# EAGLE design Mini PIC18F-USB Trainer_SCH (EAGLE 9.6.2)
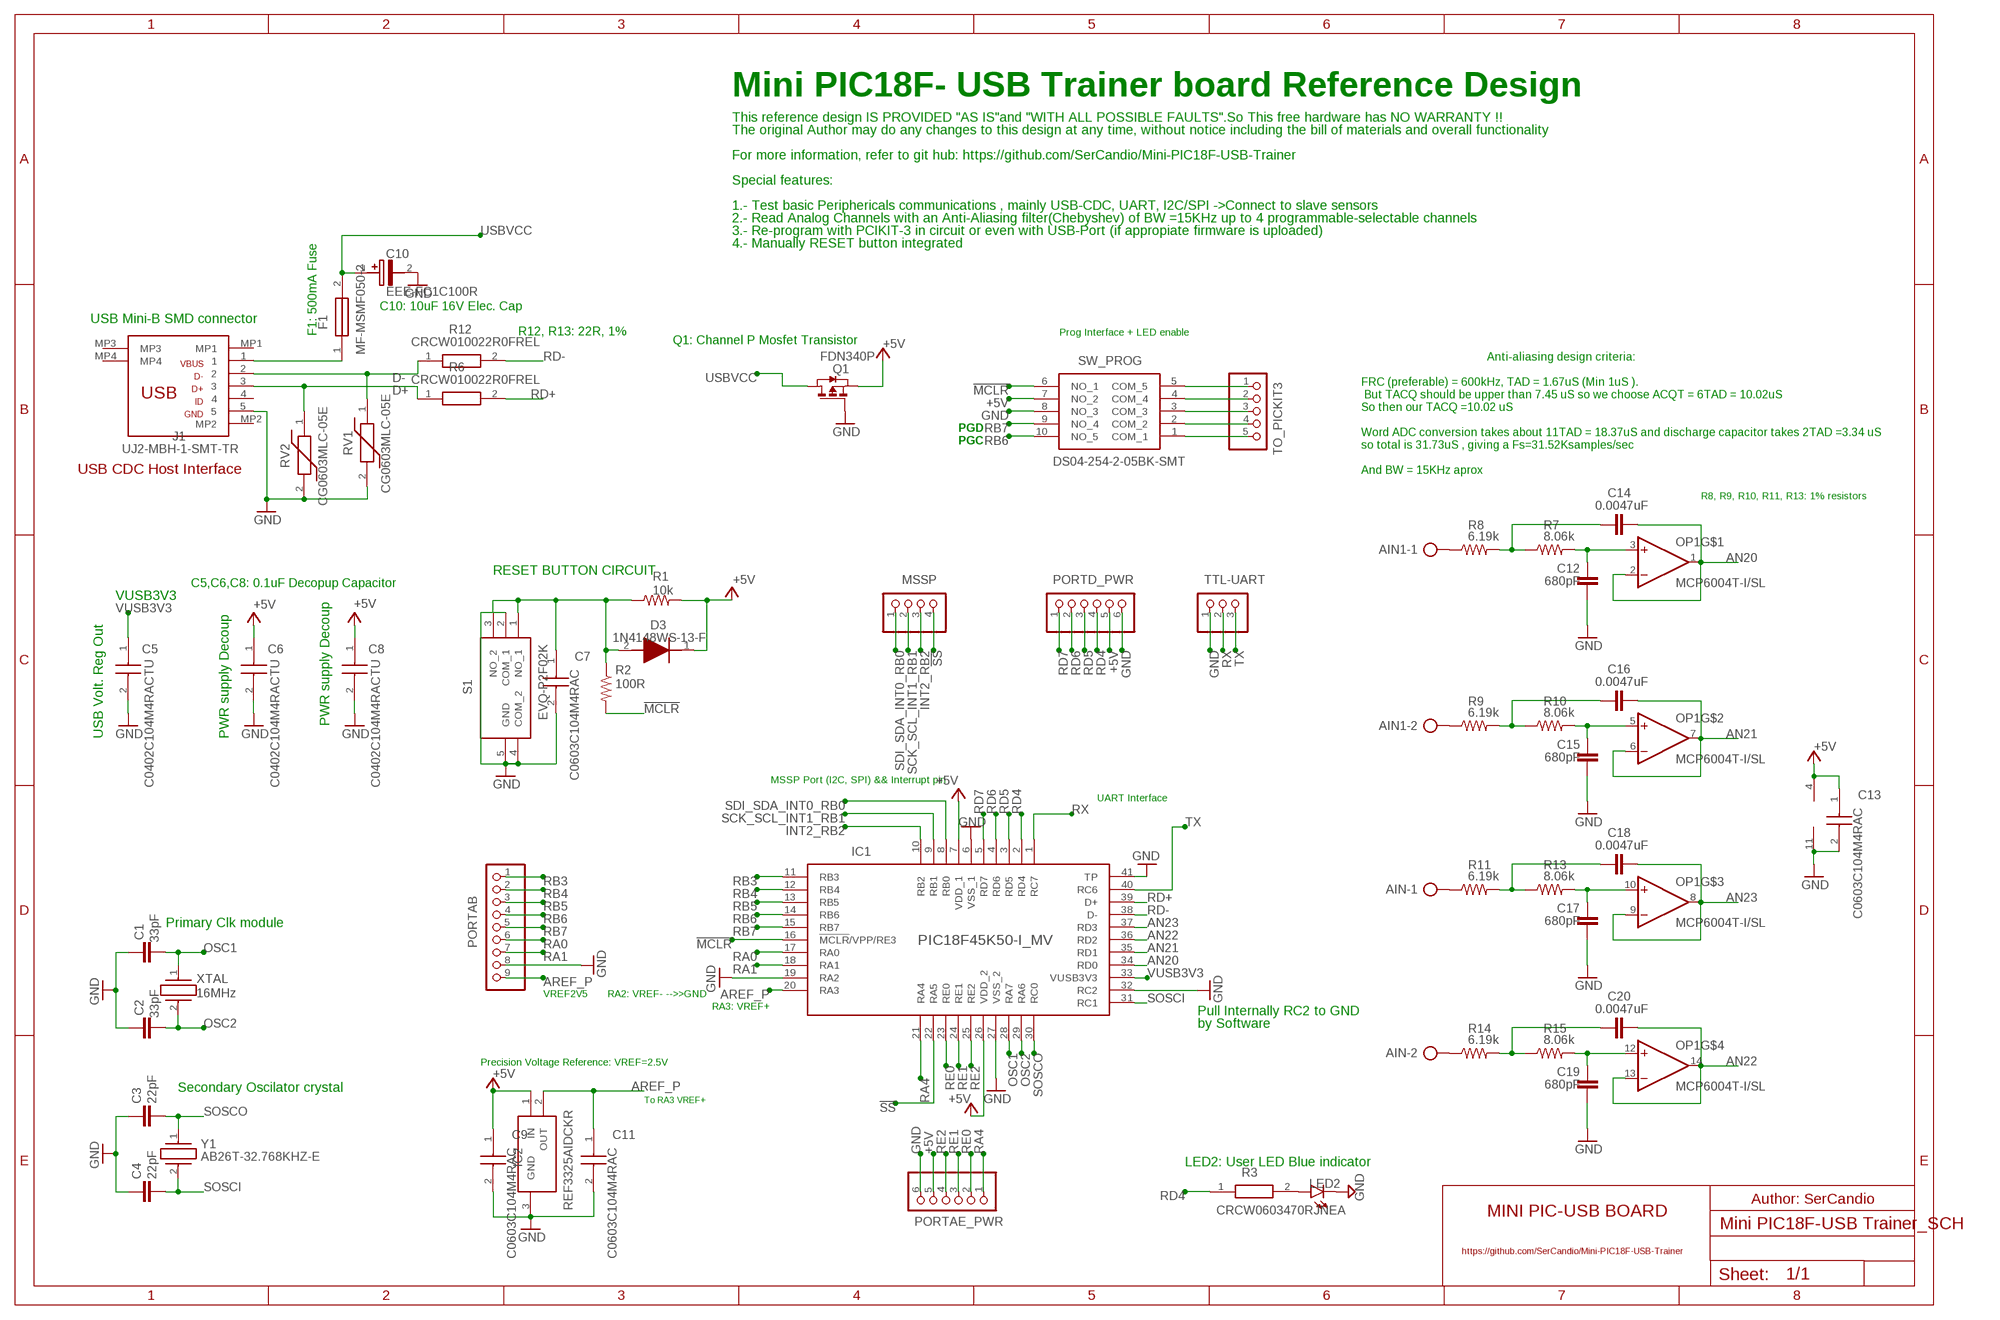
[diagram p0: schematic, sheet 1]

## Parts
AIN  AK500/2-H  [AK500/2-H]
AIN1  AK500/2-H  [AK500/2-H]
C1  33pF  C-EUC0603K  [C0603K]
C2  33pF  C-EUC0603K  [C0603K]
C3  22pF  C-EUC0603K  [C0603K]
C4  22pF  C-EUC0603K  [C0603K]
C5  C0402C104M4RACTU  [C0402C104J4RACTU]
C6  C0402C104M4RACTU  [C0402C104J4RACTU]
C7  C0603C104M4RAC  [CAPC1608X95N]
C8  C0402C104M4RACTU  [C0402C104J4RACTU]
C9  C0603C104M4RAC  [CAPC1608X95N]
C10  EEE-FC1C100R  [EEE1AA220WR]
C11  C0603C104M4RAC  [CAPC1608X95N]
C12  680pF  C-EUC0603K  [C0603K]
C13  C0603C104M4RAC  [CAPC1608X95N]
C14  0.0047uF  C-EUC0603K  [C0603K]
C15  680pF  C-EUC0603K  [C0603K]
C16  0.0047uF  C-EUC0603K  [C0603K]
C17  680pF  C-EUC0603K  [C0603K]
C18  0.0047uF  C-EUC0603K  [C0603K]
C19  680pF  C-EUC0603K  [C0603K]
C20  0.0047uF  C-EUC0603K  [C0603K]
D3  1N4148WS-13-F  [SOD2513X120N]
F1  MF-MSMF050-2  [FUSC4632X85N]
IC1  PIC18F45K50-I_MV  [QFN40P500X500X55-41N]
IC2  REF3325AIDCKR  [SOT65P210X110-3N]
J1  UJ2-MBH-1-SMT-TR  [UJ2MBH1SMTTR]
LED2  LEDCHIP-LED0805  [CHIP-LED0805]
MSSP  PINHD-1X4  [1X04]
OP1  MCP6004T-I/SL  [SOIC127P600X175-14M]
PORTAB  PINHD-1X9  [1X09]
PORTAE_PWR  PINHD-1X6  [1X06]
PORTD_PWR  PINHD-1X6  [1X06]
Q1  FDN340P  [SOT95P237X112-3N]
R1  10k  R-US_R0402  [R0402]
R2  100R  R-US_R0402  [R0402]
R3  CRCW0603470RJNEA  [RESC1608X50N]
R6  CRCW010022R0FREL  [RESC0402X15N]
R7  8.06k  R-US_R0603  [R0603]
R8  6.19k  R-US_R0603  [R0603]
R9  6.19k  R-US_R0603  [R0603]
R10  8.06k  R-US_R0603  [R0603]
R11  6.19k  R-US_R0603  [R0603]
R12  CRCW010022R0FREL  [RESC0402X15N]
R13  8.06k  R-US_R0603  [R0603]
R14  6.19k  R-US_R0603  [R0603]
R15  8.06k  R-US_R0603  [R0603]
RV1  CG0603MLC-05E  [VARC1608X55N]
RV2  CG0603MLC-05E  [VARC1608X55N]
S1  EVQ-P2F02K  [EVQP2V02W]
SW_PROG  DS04-254-2-05BK-SMT  [DS04254205BKSMT]
TO_PICKIT3  PINHD-1X5/90  [1X05/90]
TTL-UART  PINHD-1X3/90  [1X03/90]
XTAL  16MHz  LFXTAL003237REEL  [LFXTAL020423CUTT]
Y1  AB26T-32.768KHZ-E  [AB26T32768KHZE]

## Nets
!MCLR: IC1.16(!MCLR!/VPP/RE3) R2.2 SW_PROG.6(NO_1)
!SS: IC1.22(RA5) MSSP.4
+5V: C6.1 C8.1 C9.1 C13.1 D3.1(K) IC1.7(VDD_1) IC1.26(VDD_2) IC2.1(IN) OP1.4(V+) PORTAE_PWR.5 PORTD_PWR.5 Q1.2(S) R1.2 SW_PROG.7(NO_2)
AN20: C14.2 IC1.34(RD0) OP1.1(OUT) OP1.2(-IN)
AN21: C16.2 IC1.35(RD1) OP1.6(-IN) OP1.7(OUT)
AN22: C20.2 IC1.36(RD2) OP1.13(-IN) OP1.14(OUT)
AN23: C18.2 IC1.37(RD3) OP1.8(OUT) OP1.9(-IN)
AREF_P: C11.1 IC1.20(RA3) IC2.2(OUT) PORTAB.9
D+: J1.3 R6.1 RV2.1
D-: J1.2 R12.1 RV1.1
GND: C1.1 C2.1 C3.1 C4.1 C5.2 C6.2 C7.2 C8.2 C9.2 C10.2(-) C11.2 C12.2 C13.2 C15.2 C17.2 C19.2 IC1.6(VSS_1) IC1.19(RA2) IC1.27(VSS_2) IC1.32(RC2) IC1.41(TP) IC2.3(GND) J1.5 LED2.C OP1.11(V-) PORTAB.8 PORTAE_PWR.6 PORTD_PWR.6 Q1.1(G) RV1.2 RV2.2 S1.2(COM_1) S1.4(COM_2) S1.5(GND) SW_PROG.8(NO_3) TTL-UART.1
INT2_RB2: IC1.10(RB2) MSSP.3
N$1: SW_PROG.5(COM_5) TO_PICKIT3.1
N$2: C7.1 D3.2(A) R1.1 R2.1 S1.1(NO_1) S1.3(NO_2)
N$3: SW_PROG.4(COM_4) TO_PICKIT3.2
N$4: SW_PROG.3(COM_3) TO_PICKIT3.3
N$5: SW_PROG.2(COM_2) TO_PICKIT3.4
N$6: F1.1 J1.1
N$7: AIN.1 R11.1
N$8: SW_PROG.1(COM_1) TO_PICKIT3.5
N$9: LED2.A R3.2
N$10: AIN.2 R14.1
N$11: C14.1 R7.1 R8.2
N$12: C12.1 OP1.3(+IN) R7.2
N$13: AIN1.2 R9.1
N$14: C16.1 R9.2 R10.1
N$15: C15.1 OP1.5(+IN) R10.2
N$16: AIN1.1 R8.1
N$17: C18.1 R11.2 R13.1
N$18: C17.1 OP1.10(+IN) R13.2
N$20: C20.1 R14.2 R15.1
N$21: C19.1 OP1.12(+IN) R15.2
OSC1: C1.2 IC1.28(RA7) XTAL.1
OSC2: C2.2 IC1.29(RA6) XTAL.2
RA0: IC1.17(RA0) PORTAB.6
RA1: IC1.18(RA1) PORTAB.7
RA4: IC1.21(RA4) PORTAE_PWR.1
RB3: IC1.11(RB3) PORTAB.1
RB4: IC1.12(RB4) PORTAB.2
RB5: IC1.13(RB5) PORTAB.3
RB6: IC1.14(RB6) PORTAB.4 SW_PROG.10(NO_5)
RB7: IC1.15(RB7) PORTAB.5 SW_PROG.9(NO_4)
RD4: IC1.2(RD4) PORTD_PWR.4 R3.1
RD5: IC1.3(RD5) PORTD_PWR.3
RD6: IC1.4(RD6) PORTD_PWR.2
RD7: IC1.5(RD7) PORTD_PWR.1
RD+: IC1.39(D+) R6.2
RD-: IC1.38(D-) R12.2
RE0: IC1.23(RE0) PORTAE_PWR.2
RE1: IC1.24(RE1) PORTAE_PWR.3
RE2: IC1.25(RE2) PORTAE_PWR.4
RX: IC1.1(RC7) TTL-UART.2
SCK_SCL_INT1_RB1: IC1.9(RB1) MSSP.2
SDI_SDA_INT0_RB0: IC1.8(RB0) MSSP.1
SOSCI: C4.2 IC1.31(RC1) Y1.2
SOSCO: C3.2 IC1.30(RC0) Y1.1
TX: IC1.40(RC6) TTL-UART.3
USBVCC: C10.1(+) F1.2 Q1.3(D)
VUSB3V3: C5.1 IC1.33(VUSB3V3)
Unconnected: J1.4 J1.MP1 J1.MP2 J1.MP3 J1.MP4

## Notes on the sheet
- Mini PIC18F- USB Trainer board Reference Design
- This reference design IS PROVIDED "AS IS"and "WITH ALL POSSIBLE FAULTS".So This free hardware has NO WARRANTY !!
- The original Author may do any changes to this design at any time, without notice including the bill of materials and overall functionality
- For more information, refer to git hub: https://github.com/SerCandio/Mini-PIC18F-USB-Trainer
- Special features:
- 1.- Test basic Periphericals communications , mainly USB-CDC, UART, I2C/SPI ->Connect to slave sensors
- 2.- Read Analog Channels with an Anti-Aliasing filter(Chebyshev) of BW =15KHz up to 4 programmable-selectable channels
- 3.- Re-program with PCIKIT-3 in circuit or even with USB-Port (if appropiate firmware is uploaded)
- 4.- Manually RESET button integrated
- C10: 10uF 16V Elec. Cap
- USB Mini-B SMD connector
- F1: 500mA Fuse | R12, R13: 22R, 1% | Q1: Channel P Mosfet Transistor | Prog Interface + LED enable
- Anti-aliasing design criteria:
- FRC (preferable) = 600kHz, TAD = 1.67uS (Min 1uS ).
- But TACQ should be upper than 7.45 uS so we choose ACQT = 6TAD = 10.02uS
- So then our TACQ =10.02 uS
- PGD
- PGC | Word ADC conversion takes about 11TAD = 18.37uS and discharge capacitor takes 2TAD =3.34 uS
- so total is 31.73uS , giving a Fs=31.52Ksamples/sec
- USB CDC Host Interface | And BW = 15KHz aprox
- R8, R9, R10, R11, R13: 1% resistors
- RESET BUTTON CIRCUIT
- C5,C6,C8: 0.1uF Decopup Capacitor
- VUSB3V3
- PWR supply Decoup
- USB Volt. Reg Out | PWR supply Decoup
- MSSP Port (I2C, SPI) && Interrupt pin
- UART Interface
- Primary Clk module
- VREF2V5 | RA2: VREF- -->>GND
- RA3: VREF+
- Pull Internally RC2 to GND
- by Software
- Precision Voltage Reference: VREF=2.5V
- Secondary Oscilator crystal
- To RA3 VREF+
- LED2: User LED Blue indicator
- Author: SerCandio
- MINI PIC-USB BOARD
- https://github.com/SerCandio/Mini-PIC18F-USB-Trainer

## Library data of the parts
AIN AIN1 = BAT__MON_SMD_CHINA:AK500/2-H: CONNECTOR Aug. 2004 / PTR Meßtechnik: Die Bezeichnung der Serie AK505 wurde geändert. Es handelt sich hierbei um AK500 in horizontaler Ausführung.; LCSC_PART_NUMBER: C91153; LCSC_PRICE_STOCK: https://lcsc.com/product-detail/Screw-terminal_Phoenix-Contact-1729128_C91153.html; MANUFACTURER_DATASHEET: https://datasheet.lcsc.com/lcsc/1810161748_Phoenix-Contact-1729128_C91153.pdf; MANUFACTURER_NAME: Phoenix Contact; MANUFACTURER_PART_NUMBER: 1729128
C1 C2 = rcl:C-EU: CAPACITOR, European symbol; DESCRIPTION: Capacitores cerámicos de capas múltiples (MLCC) - SMD/SMT WCAP-CSGP 33pF 0603 5% 16V MLCC; MANUFACTURER_DATASHEET: https://www.we-online.com/catalog/datasheet/885012006020.pdf; MANUFACTURER_NAME: Wurth Elektronik; MANUFACTURER_PART_NUMBER: 885012006020; MOUSER_PART_NUMBER: 710-885012006020; MOUSER_PRICE_STOCK: https://www.mouser.pe/ProductDetail/Wurth-Elektronik/885012006020?qs=0KOYDY2FL29J9DnfI4btSg%3D%3D; SPICEPREFIX: C
C3 C4 = rcl:C-EU: CAPACITOR, European symbol; DESCRIPTION: Capacitores cerámicos de capas múltiples (MLCC) - SMD/SMT 16V 22pF C0G 0603 5%; MANUFACTURER_DATASHEET: https://www.mouser.pe/datasheet/2/40/C0GNP0_Dielectric-2952720.pdf; MANUFACTURER_NAME: KYOCERA AVX; MANUFACTURER_PART_NUMBER: 0603YA220JAT2A; MOUSER_PART_NUMBER: 581-0603YA220JAT2A; MOUSER_PRICE_STOCK: https://www.mouser.pe/ProductDetail/KYOCERA-AVX/0603YA220JAT2A?qs=gEbkM7q0lx9TTxqV7ITXlA%3D%3D; SPICEPREFIX: C
C5 C6 C8 = SamacSys_Parts:C0402C104M4RACTU: SMD Comm X7R, Ceramic, 0.1 uF, 20%, 16 VDC, 40 VDC, 125C, -55C, X7R, SMD, MLCC, Temperature Stable, Class II, 10 % , 5 GOhms, 1.21 mg, 0402, 1mm, 0.5mm, 0.5mm, 0.3mm, 0.3mm, 10000, 78 Weeks, 80 Source: Datasheet <https://content.kemet.com/datasheets/KEM_C1002_X7R_SMD.pdf>; DESCRIPTION: SMD Comm X7R, Ceramic, 0.1 uF, 20%, 16 VDC, 40 VDC, 125C, -55C, X7R, SMD, MLCC, Temperature Stable, Class II, 10 % , 5 GOhms, 1.21 mg, 0402, 1mm, 0.5mm, 0.5mm, 0.3mm, 0.3mm, 10000, 78 Weeks, 80; HEIGHT: 0.55mm; MANUFACTURER_NAME: KEMET; MANUFACTURER_PART_NUMBER: C0402C104M4RACTU; MOUSER_PART_NUMBER: 80-C0402C104M4R; MOUSER_PRICE-STOCK: https://www.mouser.co.uk/ProductDetail/KEMET/C0402C104M4RACTU?qs=JZ1tlzCDhS7cY%252B6lsIooCQ%3D%3D
C7 C9 C11 C13 = SamacSys_Parts:C0603C104M4RAC: Cap Ceramic 0.1uF 16V X7R 20% SMD 0603 125C Bulk Source: Datasheet <https://www.arrow.com/en/products/c0603c104m4rac/kemet-corporation>; DESCRIPTION: Cap Ceramic 0.1uF 16V X7R 20% SMD 0603 125C Bulk; HEIGHT: 0.95mm; MANUFACTURER_NAME: KEMET; MANUFACTURER_PART_NUMBER: C0603C104M4RAC; MOUSER_PART_NUMBER: 80-C0603C104M4RAC; MOUSER_PRICE-STOCK: https://www.mouser.co.uk/ProductDetail/KEMET/C0603C104M4RAC?qs=sykUljcfnH2CXqY4UGVWfw%3D%3D
C10 = SamacSys_Parts:EEE-FC1C100R: 16V 10 uF B case FC SMD Panasonic 10uF 16 V dc Aluminium Electrolytic Capacitor, FC SMD Series 1000h 4 (Dia.) x 5.4mm Source: Datasheet <http://industrial.panasonic.com/cdbs/www-data/pdf/RDE0000/ABA0000C1172.pdf>; DESCRIPTION: 16V 10 uF B case FC SMD Panasonic 10uF 16 V dc Aluminium Electrolytic Capacitor, FC SMD Series 1000h 4 (Dia.) x 5.4mm; HEIGHT: 5.5mm; MANUFACTURER_NAME: Panasonic; MANUFACTURER_PART_NUMBER: EEE-FC1C100R; MOUSER_PART_NUMBER: 667-EEE-FC1C100R; MOUSER_PRICE-STOCK: https://www.mouser.co.uk/ProductDetail/Panasonic/EEE-FC1C100R?qs=wEytwf7f49EMPs9c%252BHR3OQ%3D%3D
C12 C15 C17 C19 = rcl:C-EU: CAPACITOR, European symbol; DESCRIPTION: Capacitores cerámicos de capas múltiples (MLCC) - SMD/SMT WCAP-CSGP 680pF 0603 5% 16V MLCC; MANUFACTURER_DATASHEET: https://www.we-online.com/catalog/datasheet/885012006028.pdf; MANUFACTURER_NAME: Wurth Elektronik; MANUFACTURER_PART_NUMBER: 885012006028; MOUSER_PART_NUMBER: 710-885012006028; MOUSER_PRICE_STOCK: https://www.mouser.pe/ProductDetail/Wurth-Elektronik/885012006028?qs=0KOYDY2FL2%252BbVJuWcWMePg%3D%3D; SPICEPREFIX: C
C14 C16 C18 C20 = rcl:C-EU: CAPACITOR, European symbol; DESCRIPTION: Capacitores cerámicos de capas múltiples (MLCC) - SMD/SMT 0603 4700pF 16volts X7R 5%; MANUFACTURER_DATASHEET: https://www.vishay.com/doc?28548; MANUFACTURER_NAME: VISHAY; MANUFACTURER_PART_NUMBER: VJ0603Y472JXJCW1BC; MOUSER_PART_NUMBER: 77-VJ0603Y472JXJCBC; MOUSER_PRICE_STOCK: https://www.mouser.pe/ProductDetail/Vishay-Vitramon/VJ0603Y472JXJCW1BC?qs=GkwyZfp1uEGjUR4mDFwVVg%3D%3D; SPICEPREFIX: C
D3 = Min-PIC-TRAINER_V2:1N4148WS-13-F: Diodes - General Purpose, Power, Switching 75 Vrrm 53Vr 150 mA FAST SWITCH DIODE Source: Datasheet <https://www.diodes.com/assets/Datasheets/ds30097.pdf>; ARROW_PART_NUMBER: 1N4148WS-13-F; ARROW_PRICE-STOCK: https://www.arrow.com/en/products/1n4148ws-13-f/diodes-incorporated?region=nac; DESCRIPTION: Diodes - General Purpose, Power, Switching 75 Vrrm 53Vr 150 mA FAST SWITCH DIODE; HEIGHT: 1.2mm; MANUFACTURER_NAME: Diodes Incorporated; MANUFACTURER_PART_NUMBER: 1N4148WS-13-F; MOUSER_PART_NUMBER: 621-1N4148WS-13-F; MOUSER_PRICE-STOCK: https://www.mouser.co.uk/ProductDetail/Diodes-Incorporated/1N4148WS-13-F?qs=uwE%252BXfKqZqTz4dP8PH7EKg%3D%3D
F1 = SamacSys_Parts:MF-MSMF050-2: Fuse, PTC, Resettable, SMD, 1812, 500mA Bourns 0.5A Surface Mount Resettable Fuse, 15 V Source: Datasheet <https://www.bourns.com/pdfs/mfmsmf.pdf>; DESCRIPTION: Fuse, PTC, Resettable, SMD, 1812, 500mA Bourns 0.5A Surface Mount Resettable Fuse, 15 V; HEIGHT: mm; MANUFACTURER_NAME: Bourns; MANUFACTURER_PART_NUMBER: MF-MSMF050-2; MOUSER_PART_NUMBER: 652-MF-MSMF050-2; MOUSER_PRICE-STOCK: https://www.mouser.co.uk/ProductDetail/Bourns/MF-MSMF050-2?qs=t3shhpq1i1DZ7OBD5kLNoA%3D%3D
IC1 = SamacSys_Parts:PIC18F45K50-I_MV: MCU,PIC18F45K50,48MHz,32KB Flash,UQFN40 Microchip PIC18F45K50-I/MV, 8bit PIC Microcontroller, 48MHz, 32 kB Flash, 40-Pin UQFN Source: Datasheet; DESCRIPTION: MCU,PIC18F45K50,48MHz,32KB Flash,UQFN40 Microchip PIC18F45K50-I/MV, 8bit PIC Microcontroller, 48MHz, 32 kB Flash, 40-Pin UQFN; HEIGHT: 0.55mm; MANUFACTURER_NAME: Microchip; MANUFACTURER_PART_NUMBER: PIC18F45K50-I/MV; MOUSER_PART_NUMBER: 579-PIC18F45K50-I/MV; MOUSER_PRICE-STOCK: https://www.mouser.co.uk/ProductDetail/Microchip-Technology/PIC18F45K50-I-MV?qs=X98pPdo4MrtZMwHUnlVaSA%3D%3D
IC2 = SamacSys_Parts:REF3325AIDCKR: 30ppm/C Drift, 3.9A, SOT23-3, SC70-3, UQFN-8 Voltage Reference Source: Datasheet <http://www.ti.com/general/docs/suppproductinfo.tsp?distId=10&gotoUrl=http://www.ti.com/lit/gpn/ref3312>; DESCRIPTION: 30ppm/C Drift, 3.9A, SOT23-3, SC70-3, UQFN-8 Voltage Reference; HEIGHT: 1.1mm; MANUFACTURER_NAME: Texas Instruments; MANUFACTURER_PART_NUMBER: REF3325AIDCKR; MOUSER_PART_NUMBER: 595-REF3325AIDCKR; MOUSER_PRICE-STOCK: https://www.mouser.co.uk/ProductDetail/Texas-Instruments/REF3325AIDCKR?qs=7KoJEllG3D1NudSXR%252BHUIA%3D%3D
J1 = Min-PIC-TRAINER_V2:UJ2-MBH-1-SMT-TR: USB Connectors USB 2.0 mini B jack 5 pin Horizontal SMT Source: Datasheet <https://componentsearchengine.com/Datasheets/1/UJ2-MBH-1-SMT-TR.pdf>; ARROW_PART_NUMBER: UJ2-MBH-1-SMT-TR; ARROW_PRICE-STOCK: https://www.arrow.com/en/products/uj2-mbh-1-smt-tr/cui-devices?region=nac; DESCRIPTION: USB Connectors USB 2.0 mini B jack 5 pin Horizontal SMT; HEIGHT: 3.96mm; MANUFACTURER_NAME: CUI Devices; MANUFACTURER_PART_NUMBER: UJ2-MBH-1-SMT-TR; MOUSER_PART_NUMBER: 490-UJ2-MBH-1-SMT; MOUSER_PRICE-STOCK: https://www.mouser.co.uk/ProductDetail/CUI-Devices/UJ2-MBH-1-SMT-TR?qs=5mqXD9RfOg2uumvPfpWvPw%3D%3D
LED2 = led:LED: LED OSRAM: - CHIPLED LG R971, LG N971, LY N971, LG Q971, LY Q971, LO R971, LY R971 LH N974, LH R974 LS Q976, LO Q976, LY Q976 LO Q996 - Hyper CHIPLED LW Q18S LB Q993, LB Q99A, LB R99A - SideLED LS A670, LO A670, LY A670, LG A670, LP A670 LB A673, LV A673, LT A673, LW A673 LH A674 LY A675 LS A676, LA A676, LO A676, LY A676, LW A676 LS A679, LY A679, LG A679 - Hyper Micro SIDELED® LS Y876, LA Y876, LO Y876, LY Y876 LT Y87S - SmartLED LW L88C, LW L88S LB L89C, LB L89S, LG L890 LS L89K, LO L89K, LY L89K LS L896, LA L896, LO L896, LY L896 - TOPLED LS T670, LO T670, LY T670, LG T670, LP T670 LSG T670, LSP T670, LSY T670, LOP T670, LYG T670 LG T671, LOG T671, LSG T671 LB T673, LV T673, LT T673, LW T673 LH T674 LS T676, LA T676, LO T676, LY T676, LB T676, LH T676, LSB T676, LW T676 LB T67C, LV T67C, LT T67C, LS T67K, LO T67K, LY T67K, LW E67C LS E67B, LA E67B, LO E67B, LY E67B, LB E67C, LV E67C, LT E67C LW T67C LS T679, LY T679, LG T679 LS T770, LO T770, LY T770, LG T770, LP T770 LB T773, LV T773, LT T773, LW T773 LH T774 LS E675, LA E675, LY E675, LS T675 LS T776, LA T776, LO T776, LY T776, LB T776 LHGB T686 LT T68C, LB T68C - Hyper Mini TOPLED® LB M676 - Mini TOPLED Santana® LG M470 LS M47K, LO M47K, LY M47K Source: http://www.osram.convergy.de LUXEON: - LUMILED® LXK2-PW12-R00, LXK2-PW12-S00, LXK2-PW14-U00, LXK2-PW14-V00 LXK2-PM12-R00, LXK2-PM12-S00, LXK2-PM14-U00 LXK2-PE12-Q00, LXK2-PE12-R00, LXK2-PE12-S00, LXK2-PE14-T00, LXK2-PE14-U00 LXK2-PB12-K00, LXK2-PB12-L00, LXK2-PB12-M00, LXK2-PB14-N00, LXK2-PB14-P00, LXK2-PB14-Q00 LXK2-PR12-L00, LXK2-PR12-M00, LXK2-PR14-Q00, LXK2-PR14-R00 LXK2-PD12-Q00, LXK2-PD12-R00, LXK2-PD12-S00 LXK2-PH12-R00, LXK2-PH12-S00 LXK2-PL12-P00, LXK2-PL12-Q00, LXK2-PL12-R00 Source: www.luxeon.com KINGBRIGHT: KA-3528ASYC Source: www.kingbright.com; DESCRIPTION: LED estándar - SMD (montaje superficial) WL-SMCW SMDMono TpVw Waterclr 0805 Blue; MANUFACTURER_DATASHEET: https://www.we-online.com/catalog/datasheet/150080BS75000.pdf; MANUFACTURER_NAME: Wurth Elektronik; MANUFACTURER_PART_NUMBER: 150080BS75000; MOUSER_PART_NUMBER: 710-150080BS75000; MOUSER_PRICE_STOCK: https://www.mouser.pe/ProductDetail/Wurth-Elektronik/150080BS75000?qs=sGAEpiMZZMuCm2JlHBGeflo8zLeA%2FfbJvVazZ947D6LR8N9y6U7A9Q%3D%3D
MSSP = pinhead:PINHD-1X4: PIN HEADER
OP1 = Multi-BOARDS Trainer_LIB:MCP6004T-I/SL: 1pA 4 1MHz SOIC-14 Operational Amplifier ROHS; LCSC_PART_NUMBER: C7378; LCSC_PRICE_STOCK: https://www.lcsc.com/product-detail/Operational-Amplifier_Microchip-Tech-MCP6004T-I-SL_C7378.html; MANUFACTURER_DATASHEET: https://datasheet.lcsc.com/lcsc/2304140030_Microchip-Tech-MCP6004T-I-SL----_C7378.pdf; MANUFACTURER_NAME: Microchip Tech; MANUFACTURER_PART_NUMBER: MCP6004T-I/SL; MOUSER_PART_NUMBER: 579-MCP6004T-I/SL; MOUSER_PRICE_STOCK: https://www.mouser.pe/ProductDetail/Microchip-Technology/MCP6004T-I-SL?qs=Q%2Fw7XRh99ikP9NT9semfTQ%3D%3D
PORTAB = pinhead:PINHD-1X9: PIN HEADER
PORTAE_PWR PORTD_PWR = pinhead:PINHD-1X6: PIN HEADER
Q1 = Min-PIC-TRAINER_V2:FDN340P: Trans MOSFET P-CH 20V 2A 3-Pin SuperSOT Source: Datasheet <https://www.onsemi.com/pub/Collateral/FDN340P-D.PDF>; ARROW_PART_NUMBER: FDN340P; ARROW_PRICE-STOCK: https://www.arrow.com/en/products/fdn340p/on-semiconductor?region=nac; DESCRIPTION: Trans MOSFET P-CH 20V 2A 3-Pin SuperSOT; HEIGHT: 1.12mm; MANUFACTURER_DATASHEET: https://www.onsemi.com/pdf/datasheet/fdn340p-d.pdf; MANUFACTURER_NAME: onsemi; MANUFACTURER_PART_NUMBER: FDN340P; MOUSER_PART_NUMBER: 512-FDN340P; MOUSER_PRICE-STOCK: https://www.mouser.co.uk/ProductDetail/onsemi-Fairchild/FDN340P?qs=AMp2PTjoga9dhzFXRaqTZw%3D%3D
R1 = rcl:R-US_: RESISTOR, American symbol; DESCRIPTION: Resistores de película gruesa - SMD 10K OHM 5%; MANUFACTURER_DATASHEET: https://www.mouser.pe/datasheet/2/54/cr-1858361.pdf; MANUFACTURER_NAME: BOURNS; MANUFACTURER_PART_NUMBER: CR0402-JW-103GLF; MOUSER_PART_NUMBER: 652-CR0402-JW-103GLF; MOUSER_PRICE_STOCK: https://www.mouser.pe/ProductDetail/Bourns/CR0402-JW-103GLF?qs=%2F8Tj2%2FBce9bNso9XMxOn0g%3D%3D; SPICEPREFIX: R
R2 = rcl:R-US_: RESISTOR, American symbol; DESCRIPTION: Resistores de película gruesa - SMD 100 OHM 5%; MANUFACTURER_DATASHEET: https://www.mouser.pe/datasheet/2/54/cr-1858361.pdf; MANUFACTURER_NAME: Bourns; MANUFACTURER_PART_NUMBER: CR0402-JW-101GLF; MOUSER_PART_NUMBER: 652-CR0402JW-101GLF; MOUSER_PRICE_STOCK: https://www.mouser.pe/ProductDetail/Bourns/CR0402-JW-101GLF?qs=sGAEpiMZZMtlubZbdhIBIB2E0CzLGwMIvsRrZ%2FwhHBg%3D; SPICEPREFIX: R
R3 = SamacSys_Parts:CRCW0603470RJNEA: Thick Film Resistors - SMD 1/10watt 470ohms 5% Source: Datasheet <http://www.vishay.com/docs/20035/dcrcwe3.pdf>; DESCRIPTION: Thick Film Resistors - SMD 1/10watt 470ohms 5%; HEIGHT: 0.5mm; MANUFACTURER_NAME: Vishay; MANUFACTURER_PART_NUMBER: CRCW0603470RJNEA; MOUSER_PART_NUMBER: 71-CRCW0603J-470-E3; MOUSER_PRICE-STOCK: https://www.mouser.co.uk/ProductDetail/Vishay-Dale/CRCW0603470RJNEA?qs=NW1wgvpSas3lUsjQwt8mQg%3D%3D
R6 R12 = SamacSys_Parts:CRCW010022R0FREL: Thick Film Resistors - SMD 01005 22ohms 1% 250ppm 0.031watts Source: Datasheet <https://www.vishay.com/search?searchChoice=part&query=CRCW010022R0FREL>; DESCRIPTION: Thick Film Resistors - SMD 01005 22ohms 1% 250ppm 0.031watts; HEIGHT: 0.15mm; MANUFACTURER_NAME: Vishay; MANUFACTURER_PART_NUMBER: CRCW010022R0FREL; MOUSER_PART_NUMBER: 71-CRCW010022R0FREL; MOUSER_PRICE-STOCK: https://www.mouser.co.uk/ProductDetail/Vishay-Dale/CRCW010022R0FREL?qs=r5DSvlrkXmLaYxJsk%2FhTNw%3D%3D
R7 R10 R13 R15 = rcl:R-US_: RESISTOR, American symbol; DESCRIPTION: Resistores de película gruesa - SMD 8.06K ohm 1%; MANUFACTURER_DATASHEET: https://www.mouser.pe/datasheet/2/54/cr-1858361.pdf; MANUFACTURER_NAME: BOURNS; MANUFACTURER_PART_NUMBER: CR0603-FX-8061ELF; MOUSER_PART_NUMBER: 652-CR0603FX-8061ELF; MOUSER_PRICE_STOCK: https://www.mouser.pe/ProductDetail/Bourns/CR0603-FX-8061ELF?qs=sGAEpiMZZMtlubZbdhIBIK5e%2F64Ir72eATWhi%2FoKPo4%3D; SPICEPREFIX: R
R8 R9 R11 R14 = rcl:R-US_: RESISTOR, American symbol; DESCRIPTION: Resistores de película gruesa - SMD 6.19K ohm 1%; MANUFACTURER_DATASHEET: https://www.mouser.pe/datasheet/2/54/cr-1858361.pdf; MANUFACTURER_NAME: BOURNS; MANUFACTURER_PART_NUMBER: CR0603-FX-6191ELF; MOUSER_PART_NUMBER: 652-CR0603FX-6191ELF; MOUSER_PRICE_STOCK: https://www.mouser.pe/ProductDetail/Bourns/CR0603-FX-6191ELF?qs=sGAEpiMZZMtlubZbdhIBIMinHFTiNSf6NP1ArTMWwDo%3D; SPICEPREFIX: R
RV1 RV2 = SamacSys_Parts:CG0603MLC-05E: Varistor, ESD Protector, 5VDC,20V,0603 Bourns MLC Series Power Varistor 0.5pF 20V 0603 Case Source: Datasheet; DESCRIPTION: Varistor, ESD Protector, 5VDC,20V,0603 Bourns MLC Series Power Varistor 0.5pF 20V 0603 Case; HEIGHT: 0.55mm; MANUFACTURER_NAME: Bourns; MANUFACTURER_PART_NUMBER: CG0603MLC-05E; MOUSER_PART_NUMBER: 652-CG0603MLC-05E; MOUSER_PRICE-STOCK: https://www.mouser.co.uk/ProductDetail/Bourns/CG0603MLC-05E?qs=lDok7oSghXVLNKMK69q%252BFQ%3D%3D
S1 = SamacSys_Parts:EVQ-P2F02K: Tactile Switches Light Touch Switch 4.7x3.5mm SMD midd Source: Datasheet; DESCRIPTION: Tactile Switches Light Touch Switch 4.7x3.5mm SMD midd; HEIGHT: 2.5mm; MANUFACTURER_NAME: Panasonic; MANUFACTURER_PART_NUMBER: EVQ-P2F02K; MOUSER_PART_NUMBER: 667-EVQ-P2F02K; MOUSER_PRICE-STOCK: https://www.mouser.co.uk/ProductDetail/Panasonic/EVQ-P2F02K?qs=WwqriLBepZsV0QucKJ89rg%3D%3D
SW_PROG = SamacSys_Parts:DS04-254-2-05BK-SMT: DIP SWITCH, SPST, 2.54 PITCH, FL Source: Datasheet <https://www.cuidevices.com/product/resource/ds04-254-smt.pdf>; DESCRIPTION: DIP SWITCH, SPST, 2.54 PITCH, FL; HEIGHT: 4.3mm; MANUFACTURER_NAME: CUI Devices; MANUFACTURER_PART_NUMBER: DS04-254-2-05BK-SMT; MOUSER_PART_NUMBER: 490-DS04254205BK-SMT; MOUSER_PRICE-STOCK: https://www.mouser.co.uk/ProductDetail/CUI-Devices/DS04-254-2-05BK-SMT?qs=wnTfsH77Xs6N9X5hXMPSow%3D%3D
TO_PICKIT3 = pinhead:PINHD-1X5: PIN HEADER
TTL-UART = pinhead:PINHD-1X3: PIN HEADER
XTAL = SamacSys_Parts:LFXTAL003237REEL: IQD FREQUENCY PRODUCTS - LFXTAL003237REEL - CRYSTAL, SMD, 16MHZ Source: Datasheet; DESCRIPTION: IQD FREQUENCY PRODUCTS - LFXTAL003237REEL - CRYSTAL, SMD, 16MHZ; HEIGHT: 4.3mm; MANUFACTURER_NAME: IQD; MANUFACTURER_PART_NUMBER: LFXTAL003237REEL; MOUSER_PART_NUMBER: 449-LFXTAL003237REEL; MOUSER_PRICE-STOCK: https://www.mouser.co.uk/ProductDetail/IQD/LFXTAL003237Reel?qs=e4%2FAndAAwgJlj%2FXdUQKNpg%3D%3D
Y1 = SamacSys_Parts:AB26T-32.768KHZ-E: Crystals CRYSTAL 32.7680KHZ 12.5PF T/H Source: Datasheet <https://abracon.com/Resonators/AB26T.pdf>; DESCRIPTION: Crystals CRYSTAL 32.7680KHZ 12.5PF T/H; HEIGHT: 8.2mm; MANUFACTURER_NAME: ABRACON; MANUFACTURER_PART_NUMBER: AB26T-32.768KHZ-E; MOUSER_PART_NUMBER: 815-AB26T32.768KHZE; MOUSER_PRICE-STOCK: https://www.mouser.co.uk/ProductDetail/ABRACON/AB26T-32.768KHZ-E?qs=wnTfsH77Xs4HTj7FfHFZLQ%3D%3D

## Board
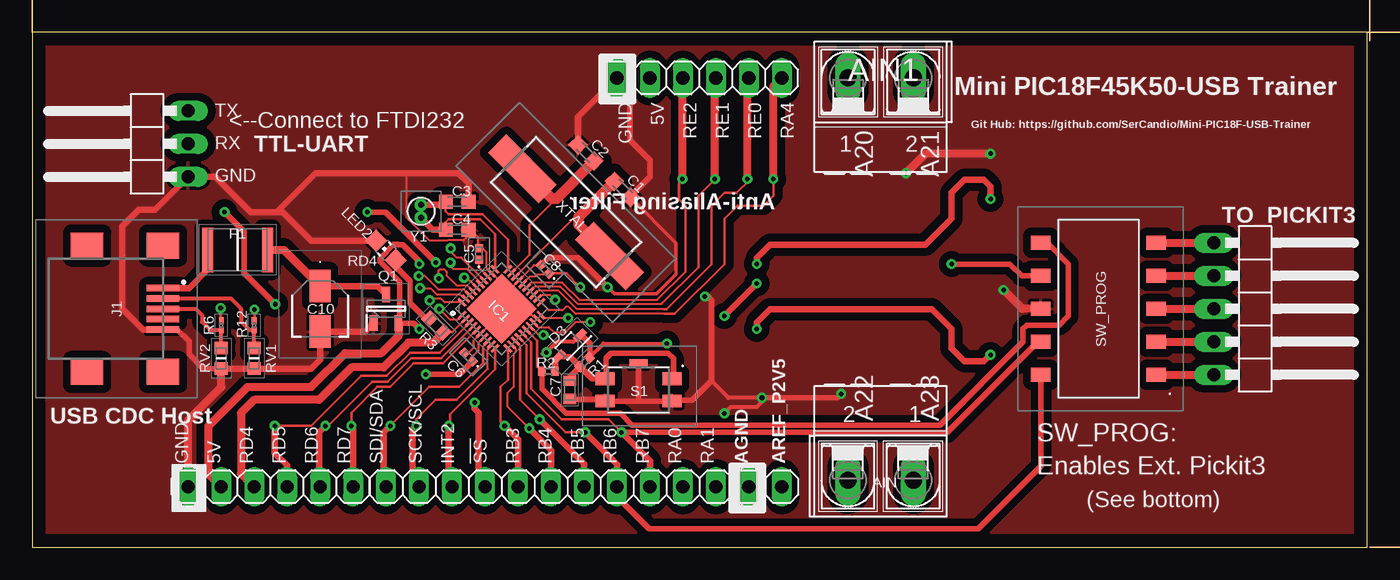
[diagram p1: board, top side]
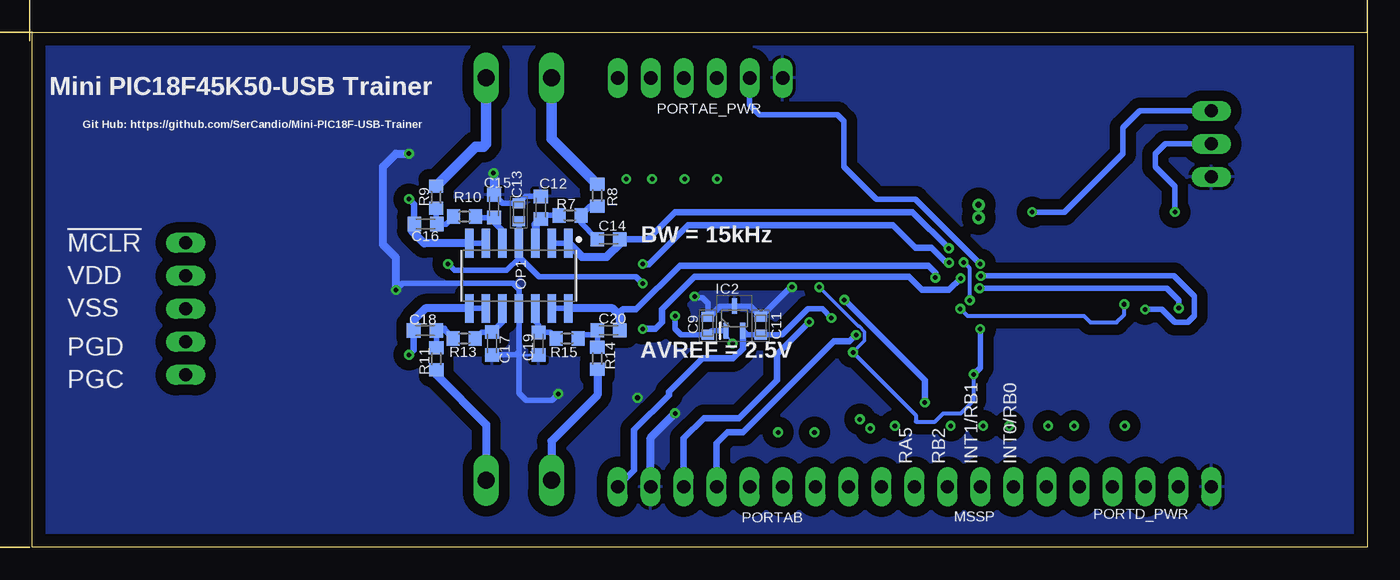
[diagram p2: board, bottom side, seen from below]

Size 102.81 x 39.63 mm. Coordinates in mm from the lower left corner, seen from the top.
Outline: 0,0 102.81,0 102.81,39.63 0,39.63 0,0
Copper layers (1*16): Top 0.035mm / dielectric 1.5mm / Bottom 0.035mm
Design rules "default": minimum track width 6mil, minimum drill 0.35mm, track to track 6mil, track to pad 6mil, pad to pad 6mil, via to via 6mil, smd to smd 6mil, copper to edge 40mil, drill to drill 6mil, minimum pad ring 10mil, minimum via ring 8mil, stop-mask expansion 4mil, vias tented up to drill 0mil, thermal gap 10mil
Milling: area 0,44.2 to 1.5,44.8; area 101.5,44.2 to 103,44.8; area 48.9,44.9 to 54.1,47.1; area 107.2,38.1 to 107.8,39.6; area 107.2,0 to 107.8,1.5; area 107.9,16.4 to 110.1,23.2; 6 lines

### Footprints (pad centres in the part's own frame; a part is rotated, then mirrored left to right if it is on the bottom)
AK500/2-H = drill 1.321 long: 1 -2.515,0; 2 2.515,0
C0603K = smd 1.05 x 1.08: 1 -0.875,0; 2 0.875,0
C0402C104J4RACTU = smd 0.62 x 0.62: 1 -0.45,0; 2 0.45,0
CAPC1608X95N = smd 0.78 x 0.98: 1 -0.7,0; 2 0.7,0
EEE1AA220WR = smd 2.5 x 1.6: 1 -1.75,0; 2 1.75,0
SOD2513X120N = smd 1.075 x 0.5: 1 -1.162,0; 2 1.162,0
FUSC4632X85N = smd 0.85 x 3.43: 1 -2.3,0; 2 2.3,0
QFN40P500X500X55-41N = smd 0.8 x 0.2: 1 -2.5,1.8; 2 -2.5,1.4; 3 -2.5,1; 4 -2.5,0.6; 5 -2.5,0.2; 6 -2.5,-0.2; 7 -2.5,-0.6; 8 -2.5,-1; 9 -2.5,-1.4; 10 -2.5,-1.8; 21 2.5,-1.8; 22 2.5,-1.4; 23 2.5,-1; 24 2.5,-0.6; 25 2.5,-0.2; 26 2.5,0.2; 27 2.5,0.6; 28 2.5,1; 29 2.5,1.4; 30 2.5,1.8 | smd 0.2 x 0.8: 11 -1.8,-2.5; 12 -1.4,-2.5; 13 -1,-2.5; 14 -0.6,-2.5; 15 -0.2,-2.5; 16 0.2,-2.5; 17 0.6,-2.5; 18 1,-2.5; 19 1.4,-2.5; 20 1.8,-2.5; 31 1.8,2.5; 32 1.4,2.5; 33 1,2.5; 34 0.6,2.5; 35 0.2,2.5; 36 -0.2,2.5; 37 -0.6,2.5; 38 -1,2.5; 39 -1.4,2.5; 40 -1.8,2.5 | smd 3.8 x 3.8: 41 0,0
SOT65P210X110-3N = smd 1.2 x 0.4: 1 -0.95,0.65; 2 -0.95,-0.65; 3 0.95,0
UJ2MBH1SMTTR = smd 0.5 x 2.5: 1 -1.6,4.405; 2 -0.8,4.405; 3 0,4.405; 4 0.8,4.405; 5 1.6,4.405 | smd 2 x 2.5: MP1 -4.86,4.405; MP2 4.86,4.405; MP3 -4.86,-1.435; MP4 4.86,-1.435
CHIP-LED0805 = smd 1.2 x 1.2: A 0,-1.05; C 0,1.05
1X04 = drill 1.016 long: 1 -3.81,0; 2 -1.27,0; 3 1.27,0; 4 3.81,0
SOIC127P600X175-14M = smd 2.201 x 0.639: 1 -2.505,3.81; 2 -2.505,2.54; 3 -2.505,1.27; 4 -2.505,0; 5 -2.505,-1.27; 6 -2.505,-2.54; 7 -2.505,-3.81; 8 2.505,-3.81; 9 2.505,-2.54; 10 2.505,-1.27; 11 2.505,0; 12 2.505,1.27; 13 2.505,2.54; 14 2.505,3.81
1X09 = drill 1.016 long: 1 -10.16,0; 2 -7.62,0; 3 -5.08,0; 4 -2.54,0; 5 0,0; 6 2.54,0; 7 5.08,0; 8 7.62,0; 9 10.16,0
1X06 = drill 1.016 long: 1 -6.35,0; 2 -3.81,0; 3 -1.27,0; 4 1.27,0; 5 3.81,0; 6 6.35,0
SOT95P237X112-3N = smd 1.2 x 0.6: 1 -1.1,0.95; 2 -1.1,-0.95; 3 1.1,0
R0402 = smd 0.6 x 0.7: 1 -0.5,0; 2 0.5,0
RESC1608X50N = smd 0.85 x 1: 1 -0.75,0; 2 0.75,0
RESC0402X15N = smd 0.525 x 0.35: 1 -0.362,0; 2 0.362,0
R0603 = smd 1 x 1.1: 1 -0.85,0; 2 0.85,0
VARC1608X55N = smd 0.95 x 1: 1 -0.8,0; 2 0.8,0
EVQP2V02W = smd 1 x 1.45: 1 -0.85,2.575; 2 0.85,2.575; 3 -0.85,-2.575; 4 0.85,-2.575 | smd 0.65 x 1.4: 5 -2.025,0
DS04254205BKSMT = smd 1.1 x 1.5: 1 -5.08,-4.45; 2 -2.54,-4.45; 3 0,-4.45; 4 2.54,-4.45; 5 5.08,-4.45; 6 5.08,4.45; 7 2.54,4.45; 8 0,4.45; 9 -2.54,4.45; 10 -5.08,4.45
1X05/90 = drill 1.016 long: 1 -5.08,-3.81; 2 -2.54,-3.81; 3 0,-3.81; 4 2.54,-3.81; 5 5.08,-3.81
1X03/90 = drill 1.016 long: 1 -2.54,-3.81; 2 0,-3.81; 3 2.54,-3.81
LFXTAL020423CUTT = smd 5.5 x 2: 1 -4.75,0; 2 4.75,0
AB26T32768KHZE = drill 0.46 pad 0.7: 1 0,0; 2 1,0

### Placement (x,y rotation side)
AIN  65.34,5.15 180 top
AIN1  65.34,36.13 0 top
C1  45.45,27.55 135 top
C2  42.64,30.36 315 top
C3  32.72,26.58 180 top
C4  32.72,24.45 180 top
C5  34.39,22.58 90 top
C6  33.59,14.64 135 top
C7  41.4,12.1 270 top
C8  39.47,21.39 135 top
C9  50.78,17.05 90 bottom
C10  22.16,18.35 270 top
C11  46.7,17.05 90 bottom
C12  63.65,26.13 90 bottom
C13  65.34,25.78 90 bottom
C14  58.43,23.71 0 bottom
C15  67.25,26.25 90 bottom
C16  72.52,24.88 180 bottom
C17  67.41,15.68 270 bottom
C18  72.57,16.68 180 bottom
C19  63.81,15.66 270 bottom
C20  58.43,16.69 0 bottom
D3  41.36,15.49 225 top
F1  15.81,22.89 0 top
IC1  36.13,18.35 45 top
IC2  48.74,17.61 90 bottom
J1  5.65,18.35 270 top
LED2  27.23,22.85 45 top
MSSP  31.05,4.65 0 top
OP1  65.34,20.89 270 bottom
PORTAB  47.56,4.65 0 top
PORTAE_PWR  51.37,36.13 180 top
PORTD_PWR  18.35,4.65 180 top
Q1  27.24,18.35 90 top
R1  42.54,14.24 45 top
R2  39.74,13.53 180 top
R3  31.11,17.06 135 top
R6  14.54,17.08 90 top
R7  61.41,25.54 180 bottom
R8  59.3,27.08 270 bottom
R9  71.71,26.95 270 bottom
R10  69.53,25.46 0 bottom
R11  71.69,14.51 90 bottom
R12  17.08,17.08 90 top
R13  69.55,16.07 0 bottom
R14  59.29,14.53 90 bottom
R15  61.63,16.07 180 bottom
RV1  17.08,14.54 270 top
RV2  14.54,14.54 270 top
S1  46.69,12.1 270 top
SW_PROG  82.12,18.35 90 top
TO_PICKIT3  94.82,18.35 270 top
TTL-UART  8.19,31.05 90 top
XTAL  41.1,25.78 135 top
Y1  29.93,26.36 270 top

### Tracks (layer width: path | path; a pad name or v marks a point on that pad's centre or on a via)
!MCLR
  Top 0.203: IC1.16 38.87,15.89 38.87,13.9 R2.2
  Top 0.406: SW_PROG.6 78.17,23.43 79.8,21.8 79.8,17.8 79.1,17.1 76.6,17.1 76.3,16.8 76.3,15.8 69.9,9.4 46.2,9.4 45.3,10.3 41.12,10.3 39.24,12.18 R2.2
!SS  (via drill 0.35)
  Top 0.152: v40.27,19.04 39.88,19.43 39.48,19.43 39.29,19.43 39.27,19.41 39.17,19.41 IC1.22
  Top 0.508: MSSP.4 34.36,5.15 34.36,10.35 34.07,10.64 v34.07,11.14
  Bottom 0.508: v34.07,11.14 34.07,12.84 v40.27,19.04
+5V  (via drill 0.35)
  Top 0.152: C8.1 39.69,20.97 38.88,20.97 38.75,20.84 38.34,20.84 IC1.26
  Top 0.203: IC1.7 34.35,15.72 34.35,15.15 33.91,14.71 C6.1 | C8.1 41.14,21.07 v42.2,20.02
  Top 0.305: D3.1 41.66,15.8 40.4,15.8 v39.6,15 | R1.2 43.97,15.67 v48.88,15.67
  Top 0.406: R1.2 42.97,14.67 42.97,15.64 42.3,16.31 D3.1 | C6.1 32.89,13.3 v30.3,13.3 | v29.8,16.8 29.35,17.25 Q1.2 28.3,17.36 28.3,20.43 26.77,21.96 26.77,22.25 27.82,23.31 28.12,23.31 28.13,23.3 28.5,23.3 29.8,22 v29.8,21.8 | SW_PROG.7 76.21,20.89 75.3,21.8 v70.8,21.8 | v53.3,17.8 v55.8,20.3
  Top 0.61: PORTD_PWR.5 13.54,5.65 13.54,9.31 16.57,12.34 21.47,12.34 24.07,14.94 26.87,14.94 28.19,16.26 Q1.2
  Bottom 0.203: IC2.1 49.39,16.3 48.88,15.79 v48.88,15.67
  Bottom 0.254: v42.2,20.02 39.17,16.99 39.1,16.99 38.7,16.59 38.7,15.9 v39.6,15
  Bottom 0.305: v39.6,15 34.75,10.15 34.75,9.66 33.29,9.66 32.64,10.3 31.3,10.3 30.3,11.3 v30.3,13.3
  Bottom 0.406: IC2.1 50.47,16.66 C9.1 52.85,16.35 53.3,16.8 v53.3,17.8 | v30.3,13.3 29.8,13.8 v29.8,16.8 | v29.8,21.8 34.8,26.8 37.8,26.8 40.3,29.3 40.3,32.8 40.8,33.3 46.8,33.3 47.56,34.06 PORTAE_PWR.5 | v70.8,21.8 70.3,21.3 66.3,21.3 65.34,22.26 OP1.4 | OP1.4 C13.1 | v55.8,20.3 56.3,20.8 63.8,20.8 65.34,22.34 OP1.4
AN20  (via drill 0.35)
  Top 0.152: v32.22,23.01 32.22,22.74 32.66,22.3 33.03,22.3 IC1.34
  Bottom 0.406: OP1.1 OP1.2
  Bottom 0.508: C14.2 55.39,23.71 53.3,25.8 35.01,25.8 v32.22,23.01
  Bottom 0.61: OP1.1 60.48,22.34 58.57,22.34 57.55,23.36 C14.2
AN21  (via drill 0.35)
  Top 0.152: v32.2,21.9 32.2,21.6 32.4,21.4 33.46,21.4 34.5,20.36 IC1.35
  Top 0.508: v73.8,26.8 73.8,27.8 73.3,28.3 71.8,28.3 70.8,27.3 70.8,25.3 68.8,23.3 56.8,23.3 55.8,22.3 v55.8,21.8
  Bottom 0.406: OP1.6 OP1.7
  Bottom 0.508: C16.2 73.4,26.4 v73.8,26.8 | v55.8,21.8 55.3,21.8 52.3,24.8 36.53,24.8 34.77,23.04 33.54,23.04 32.4,21.9 v32.2,21.9
  Bottom 0.61: OP1.7 72.62,23.39 73.57,24.34 73.57,24.71 C16.2
AN22  (via drill 0.35)
  Top 0.152: IC1.36 33.7,20.5 33.4,20.5 33.25,20.65 v33.25,20.75
  Bottom 0.406: OP1.14 OP1.13
  Bottom 0.508: C20.2 57.55,18.05 57.3,18.3 56.3,18.3 52.92,21.68 33.8,21.68 33.25,21.13 v33.25,20.75
  Bottom 0.61: C20.2 57.55,17.82 58.12,18.39 OP1.14
AN23  (via drill 0.35)
  Top 0.152: v31.3,20.7 31.3,21.3 31.4,21.4 31.7,21.4 31.9,21.2 31.9,20.9 32.65,20.15 33.49,20.15 IC1.37
  Top 0.508: v73.8,14.8 73.3,14.3 71.8,14.3 70.8,15.3 70.8,16.8 69.3,18.3 56.8,18.3 55.8,17.3 v55.8,16.8
  Bottom 0.406: OP1.9 OP1.8
  Bottom 0.508: C18.2 73.44,15.15 v73.8,14.8 | v55.8,16.8 54.8,16.8 54.3,17.3 54.3,18.3 51.8,20.8 35.3,20.8 34.3,19.8 32.2,19.8 v31.3,20.7
  Bottom 0.61: OP1.8 72.53,18.39 73.44,17.46 C18.2
AREF_P  (via drill 0.35)
  Top 0.152: v41.27,17.64 39.49,17.64 39.22,17.91 IC1.20
  Bottom 0.406: v41.27,17.64 41.97,18.34 43.07,18.34 45.06,16.35 C11.1 47.78,16.35 IC2.2
  Bottom 0.508: PORTAB.9 56.45,5.92 56.45,9.02 53.77,11.7 53.77,11.97 51.2,14.54 48.83,14.54 48.09,15.28 IC2.2
D+
  Top 0.305: RV2.1 R6.1 13.69,16.72 13.07,17.34 13.07,17.84 12.56,18.35 J1.3
D-
  Top 0.305: RV1.1 R12.1 16.69,16.72 16.07,17.34 16.07,18.34 15.26,19.15 J1.2
GND  (via drill 0.35)
  Top 0.152: C8.2 38.64,21.71 IC1.27 36.67,19.74 36.67,19.64 36.16,19.14 | IC1.19 38.79,17.57 38.49,17.87 36.61,17.87 IC1.41 | 36.16,19.14 36.07,19.04 36.07,18.41 IC1.41 | IC1.6 36.13,18.07 IC1.41 | 36.16,19.14 36.16,20.3 IC1.32 35,21.46 35,22.7 34.67,23.03 C5.2 34.3,23.12 34.3,23.9 33.75,24.45 C4.1 33.4,24.25 33.4,23.8 33.22,23.62 31.97,23.62 31.95,23.6 30.6,23.6 28.8,25.4 28.8,28.8
  Top 0.203: IC1.6 33.97,15.91 33.97,15.34 33.59,14.96 C6.2
  Top 0.254: C1.1 49.59,23.41 49.59,21.01 48.09,19.51 45.83,19.51 45.81,19.49 44.83,19.49 v44.3,20.02
  Top 0.305: 52.3,12.8 53.6,11.5 v56.2,11.5 56.2,11.2 55.8,10.8 53.8,10.8 v53.3,10.3
  Top 0.406: RV2.2 13.17,13.74 12.07,14.84 12.07,15.84 11.16,16.75 10.73,16.75 J1.5 | C7.2 43.97,11.4 S1.4 46.57,11.25 | 46.57,11.25 S1.2 49.31,11.3 50.8,11.3 52.3,12.8 52.3,19 52,19.3 v51.8,19.3 | S1.5 46.69,11.37 46.57,11.25 | C8.2 39.74,22.3 42.02,22.3 v44.3,20.02 | C1.1 46.07,27.02 47.56,28.51 47.56,29.78 46.02,31.32 46.02,35.63 45.52,36.13 PORTAE_PWR.6 | v62.3,11.8 62,11.5 v56.2,11.5
  Top 0.508: RV2.2 RV1.2 21.47,13.74 22.16,14.43 C10.2 25.64,16.6 Q1.1 | 10.73,16.75 8.52,16.75 6.92,18.35 6.92,24.7 8.19,25.97 9.46,25.97 TTL-UART.1 14.09,28.51 16.8,25.8 18.8,25.8 | C2.1 42.02,33.13 PORTAE_PWR.6 | LED2.C 21.49,23.59 19.28,25.8 18.8,25.8 | C3.1 33.59,28 32.8,28.8 28.8,28.8 21.8,28.8 18.8,25.8
  Top 0.61: PORTD_PWR.6 12,9.77 14.54,12.31 RV2.2 | SW_PROG.8 76.25,18.35 v74.8,19.8 | v67.3,28.8 68.8,30.3 v73.8,30.3
  Bottom 0.203: C19.2 65.09,14.79 65.34,15.03
  Bottom 0.406: C17.2 65.57,14.8 65.34,15.03 | 65.34,15.03 OP1.11 65.34,19.84 65.8,20.3 74.3,20.3 v74.8,19.8 | C12.2 64.81,27.01 C13.2 66.6,26.48 C15.2 | v44.3,20.02 44.44,20.02 C11.2 47.51,18.56 IC2.3 49.85,18.56 50.66,17.75 C9.2 50.78,18.78 51.2,19.2 51.6,19.2 51.7,19.3 v51.8,19.3 | 65.34,15.03 65.34,11.84 64.8,11.3 62.8,11.3 v62.3,11.8
  Bottom 0.61: v74.8,19.8 74.8,22.3 75.8,23.3 75.8,29.3 74.8,30.3 v73.8,30.3 | v67.3,28.8 67.3,27.18 C15.2 | PORTAB.8 55.18,8.42 v53.3,10.3
  pour Top (isolate 0.61): 0,39.5 103,39.5 103,0 0,0
  pour Bottom (isolate 0.813): 0,39.5 103,39.5 103,0 0,0
INT2_RB2  (via drill 0.35)
  Top 0.203: IC1.10 35.63,13.71 32.17,10.24 32.17,9.44 v32.07,9.34
  Top 0.508: v32.07,9.34 32.07,4.9 MSSP.3
N$1
  Top 0.61: SW_PROG.5 TO_PICKIT3.1
N$2
  Top 0.406: D3.2 41.41,14.67 R1.1 | R1.1 41.4,13.1 C7.1 | R1.1 43.12,12.95 S1.3 44.17,13.01 44.17,14.54 44.57,14.94 48.97,14.94 49.37,14.54 49.37,13.05 S1.1
  Top 0.508: R2.1 40.24,14.38 D3.2
N$3
  Top 0.61: SW_PROG.4 TO_PICKIT3.2
N$4
  Top 0.61: SW_PROG.3 TO_PICKIT3.3
N$5
  Top 0.61: SW_PROG.2 TO_PICKIT3.4
N$6
  Top 0.508: J1.1 12.07,19.95 13.51,21.39 F1.1
N$7
  Bottom 0.61: R11.1 71.69,13.27 67.86,9.44 AIN.1
N$8
  Top 0.61: SW_PROG.1 TO_PICKIT3.5 | TO_PICKIT3.5 91.14,13.27 91.57,12.84 91.44,12.84 TO_PICKIT3.5
N$9
  Top 0.406: LED2.A 27.97,21.6 29.08,20.49 29.08,18.79 30.28,17.59 R3.2
N$10
  Bottom 0.61: R14.1 59.29,11.7 62.83,8.16 AIN.2
N$11
  Bottom 0.406: C14.1 60.56,24.96 R7.1 59.87,26.23 R8.2
N$12
  Bottom 0.406: R7.2 63.37,25.54 C12.1
  Bottom 0.61: C12.1 64.07,24.84 OP1.3
N$13
  Bottom 0.813: R9.1 68.67,30.84 68.07,30.84 67.86,31.05 AIN1.2
N$14
  Bottom 0.406: R10.1 70.96,24.88 C16.1 71.71,24.94 R9.2
N$15
  Bottom 0.406: R10.2 68.6,25.38 C15.1 67.25,25.02 66.57,24.34 66.57,23.43 OP1.5
N$16
  Bottom 0.813: R8.1 62.83,31.45 AIN1.1
N$17
  Bottom 0.406: R13.1 71.07,16.74 71.07,16.84 71.53,16.84 C18.1 R11.2
N$18
  Bottom 0.406: R13.2 68.22,16.55 C17.1 66.61,17.35 OP1.10
N$20
  Bottom 0.406: R14.2 59.29,16.34 | 59.29,16.34 59.29,16.68 C20.1 | R15.1 60.51,16.34 59.29,16.34
N$21
  Bottom 0.406: R15.2 62.95,16.54 C19.1 63.81,17.08 64.07,17.34 OP1.12
OSC1
  Top 0.152: IC1.28 38.73,22.37
  Top 0.203: 38.73,22.37 41.77,25.41 42.07,25.41
  Top 0.813: C1.2 42.07,25.41 42.07,24.81 XTAL.1
OSC2
  Top 0.152: IC1.29 38.3,22.5
  Top 0.203: 38.3,22.5 38.3,24.8 40.34,26.84 40.36,26.84
  Top 0.813: C2.2 40.36,26.84 40.04,26.84 XTAL.2
RA0  (via drill 0.35)
  Top 0.152: IC1.17 38.99,16.33 v39.37,16.33
  Bottom 0.508: v39.37,16.33 39.86,15.84 41.07,15.84 48.07,8.84 49.27,8.84 50.1,8.01 PORTAB.6
RA1  (via drill 0.35)
  Top 0.152: IC1.18 38.95,16.94 39.77,16.94 40.17,16.54 41.07,16.54 41.87,17.34 v42.97,17.34
  Bottom 0.508: v42.97,17.34 45.47,14.84 45.47,12.84 48.37,9.94 51.07,9.94 52.64,8.37 PORTAB.7
RA4  (via drill 0.35)
  Top 0.152: 48.68,17.96 41.84,17.96 41.3,18.5 41.09,18.5 40.82,18.23 39.78,18.23 IC1.21
  Top 0.203: 48.68,17.96 49.46,17.96 53.3,21.8 53.3,25.3 54.3,26.3 56.3,26.3 57.07,27.07 v57.07,28.34
  Top 0.61: v57.07,28.34 57.07,35.48 PORTAE_PWR.1
RB3  (via drill 0.35)
  Top 0.203: IC1.11 36.62,12.89 36.07,12.34 36.07,9.64 v36.37,9.34
  Top 0.508: v36.37,9.34 37.4,8.31 PORTAB.1
RB4  (via drill 0.35)
  Top 0.152: IC1.12 37.21,15.29 37.21,15 37.07,14.87 37.07,12.34 36.57,11.84 36.57,10.84 v38.27,9.14
  Top 0.508: v38.27,9.14 39.94,7.47 PORTAB.2
RB5  (via drill 0.35)
  Top 0.203: IC1.13 37.57,15.5 37.57,11.34 v39.07,9.84
  Top 0.508: v39.07,9.84 42.48,6.43 PORTAB.3
RB6  (via drill 0.35)
  Top 0.203: IC1.14 38.07,15.56 38.07,11.84 41.07,8.84 v42.57,8.84
  Top 0.406: SW_PROG.10 77.67,6.21 72.88,1.42 47.49,1.42 45.02,3.89 PORTAB.4
  Top 0.508: v42.57,8.84 45.02,6.39 PORTAB.4
RB7  (via drill 0.35)
  Top 0.203: IC1.15 38.43,15.77 38.43,12.18 40.77,9.84 44.37,9.84 v45.37,8.84
  Top 0.406: SW_PROG.9 77.47,15.81 70.5,8.84 v45.37,8.84
  Top 0.508: v45.37,8.84 47.56,6.65 PORTAB.5
RD4
  Top 0.152: IC1.2 32.33,16.53 R3.1
  Top 0.61: R3.1 30.85,15.74 28.97,15.74 27.07,13.84 24.57,13.84 22.07,11.34 17.07,11.34 16.07,10.34 16.07,5.66 PORTD_PWR.4
RD5  (via drill 0.35)
  Top 0.203: IC1.3 31.35,14.98 29.1,14.98 27.3,13.18 25.31,13.18 21.47,9.34 v18.67,9.34
  Top 0.508: PORTD_PWR.3 19.62,6.29 18.67,7.24 v18.67,9.34
RD6  (via drill 0.35)
  Top 0.203: IC1.4 31.47,14.54 29.17,14.54 27.37,12.74 26.17,12.74 22.77,9.34 v22.57,9.34
  Top 0.508: v22.57,9.34 22.07,8.84 22.07,4.74 PORTD_PWR.2
RD7  (via drill 0.35)
  Top 0.203: IC1.5 31.64,14.14 29.37,14.14 27.57,12.34 26.57,12.34 24.57,10.34 v24.57,9.34
  Top 0.508: v24.57,9.34 24.7,9.21 PORTD_PWR.1
RD+  (via drill 0.35)
  Top 0.152: IC1.39 33.27,19.13 32.97,19.43 31.17,19.43 30.7,19.9 29.89,19.9 v29.85,19.94
  Top 0.203: R6.2 14.5,17.48 v14.5,18.4
  Bottom 0.406: v14.5,18.4 14.5,19 15.44,19.94 v29.85,19.94
RD-  (via drill 0.35)
  Top 0.152: IC1.38 33.27,19.8 31.3,19.8 30.22,20.88 v29.75,20.88
  Top 0.203: R12.2 17.1,17.46 v17.1,18.3
  Bottom 0.406: v29.75,20.88 14.88,20.88 13.3,19.3 13.3,17.8 13.8,17.3 14.8,17.3 15.8,18.3 v17.1,18.3
RE0  (via drill 0.35)
  Top 0.152: 48.65,18.33 41.94,18.33 40.53,19.74 38.93,19.74 IC1.23 | 55.18,28.23 v55.07,28.34
  Top 0.203: 48.65,18.33 48.83,18.33 52.3,21.8 52.3,26.3 53.3,27.3 54.25,27.3 55.18,28.23
  Top 0.61: v55.07,28.34 55.07,36.02 PORTAE_PWR.2
RE1  (via drill 0.35)
  Top 0.152: 48.47,18.72 42,18.72 40.67,20.05 38.67,20.05 IC1.24
  Top 0.203: 48.47,18.72 51.3,21.55 51.3,27.07 v52.57,28.34
  Top 0.61: v52.57,28.34 52.57,36.06 PORTAE_PWR.3
RE2  (via drill 0.35)
  Top 0.152: IC1.25 38.42,20.36 40.81,20.36 42.14,19.03 48.12,19.03 50.3,21.21
  Top 0.203: 50.3,21.21 50.3,26.3 49.8,26.8 49.8,28.07 v50.07,28.34
  Top 0.61: PORTAE_PWR.4 50.07,36.1 v50.07,28.34
RX  (via drill 0.35)
  Top 0.152: IC1.1 32.73,17.5 32.18,17.5 v31.33,18.35
  Top 0.406: v18.7,18.7 16.3,21.1 16.3,24.3 v14.8,25.8
  Bottom 0.305: v31.33,18.35 30.78,17.8 21.8,17.8 21.3,17.3 19.3,17.3 18.7,17.9 v18.7,18.7
  Bottom 0.406: TTL-UART.2 15.55,31.05 16.3,30.3 16.3,29.3 14.8,27.8 v14.8,25.8
SCK_SCL_INT1_RB1  (via drill 0.35)
  Top 0.152: IC1.9 35.35,15.49 35.05,15.19 35.05,13.72
  Top 0.203: v29.57,9.34 29.57,9.84 31.07,11.34 32.67,11.34 35.05,13.72
  Top 0.508: MSSP.2 29.28,5.15 29.28,9.05 v29.57,9.34
SDI_SDA_INT0_RB0  (via drill 0.35)
  Top 0.203: IC1.8 35.07,15.81 34.72,15.46 34.72,14.19 32.87,12.34 30.57,12.34 v27.57,9.34
  Top 0.508: MSSP.1 27.07,4.82 27.07,8.84 v27.57,9.34
SOSCI
  Top 0.203: C4.2 31.84,25.02 32.07,25.24 34.47,25.24 35.63,24.07 IC1.31
  Top 0.508: C4.2 30.84,24.45 Y1.2
SOSCO
  Top 0.203: C3.2 31.84,25.86 32.07,25.64 34.67,25.64 36.62,23.68 IC1.30
  Top 0.508: C3.2 31.62,26.36 Y1.1
TX  (via drill 0.35)
  Top 0.152: IC1.40 31.75,18.84 31.48,19.12 30.72,19.12 v30.6,19
  Top 0.406: v31.07,21.93 27.2,25.8 v25.8,25.8
  Bottom 0.305: v30.6,19 30.6,21.46 v31.07,21.93
  Bottom 0.406: v25.8,25.8 23.3,25.8 18.8,30.3 18.8,32.3 17.51,33.59 TTL-UART.3
USBVCC
  Top 0.508: C10.1 26.59,20.1 Q1.3
  Top 0.61: F1.2 19.37,22.89 C10.1
VUSB3V3
  Top 0.152: IC1.33 35.07,20.84 34.39,21.52 C5.1

### Text on the board
tNames: Mini PIC18F45K50-USB Trainer | GND | 5V | RE2 | RE1 | RE0 | RA4 | TX | <--Connect to FTDI232 | A20 | A21 | Git Hub: https://github.com/SerCandio/Mini-PIC18F-USB-Trainer | RX | GND | Anti-Aliasing Filter | RD4 | A22 | A23 | USB CDC Host | SW_PROG: | GND | 5V | RD4 | RD5 | RD6 | RD7 | SDI/SDA | SCK/SCL | INT2 | !SS | RB3 | RB4 | RB5 | RB6 | RB7 | RA0 | RA1 | AGND | AREF_P2V5 | Enables Ext. Pickit3 | (See bottom)
bNames: Mini PIC18F45K50-USB Trainer | Git Hub: https://github.com/SerCandio/Mini-PIC18F-USB-Trainer | BW = 15kHz | !MCLR | VDD | VSS | AVREF = 2.5V | PGD | PGC | INT0/RB0 | INT1/RB1 | RB2 | RA5